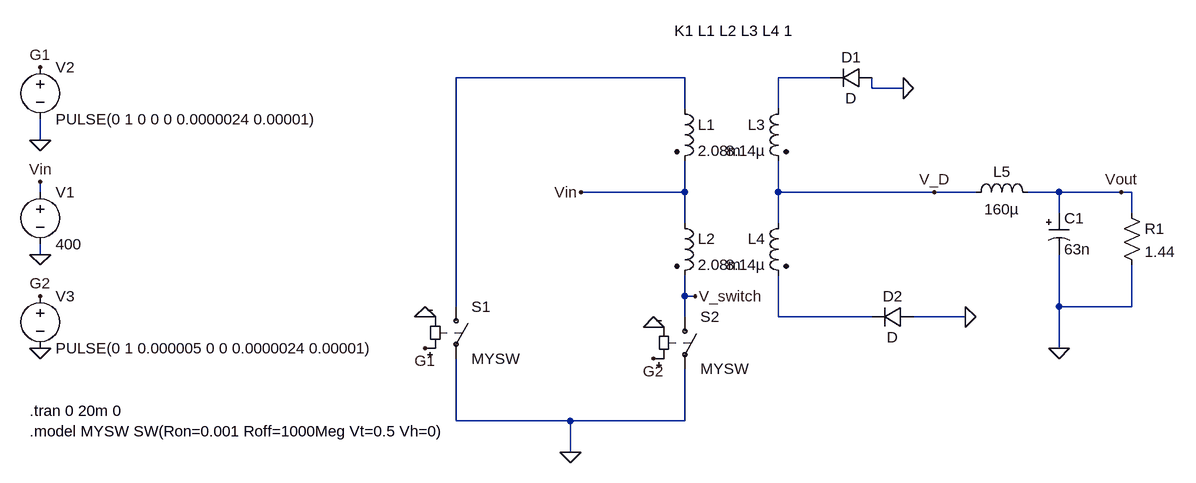
[diagram p0: schematic Analytical_Calculated_Circuit.asc]
Analytical_Calculated_Circuit.asc, the LTspice schematic file:
Version 4
SHEET 1 2220 680
WIRE 1232 -288 880 -288
WIRE 1456 -288 1376 -288
WIRE 1520 -272 1520 -288
WIRE 1568 -272 1520 -272
WIRE 1232 -240 1232 -288
WIRE 1376 -240 1376 -288
WIRE 240 -192 240 -224
WIRE 240 -112 240 -128
WIRE 1232 -112 1232 -160
WIRE 1232 -112 1072 -112
WIRE 1376 -112 1376 -160
WIRE 1616 -112 1376 -112
WIRE 1680 -112 1616 -112
WIRE 1808 -112 1760 -112
WIRE 1904 -112 1808 -112
WIRE 1920 -112 1904 -112
WIRE 1808 -80 1808 -112
WIRE 1920 -80 1920 -112
WIRE 1232 -64 1232 -112
WIRE 1376 -64 1376 -112
WIRE 240 -16 240 -32
WIRE 1232 48 1232 16
WIRE 1248 48 1232 48
WIRE 880 64 880 -288
WIRE 1808 64 1808 -16
WIRE 1920 64 1920 0
WIRE 1920 64 1808 64
WIRE 1232 80 1232 48
WIRE 1376 80 1376 16
WIRE 1520 80 1376 80
WIRE 1664 80 1584 80
WIRE 1808 128 1808 64
WIRE 880 240 880 144
WIRE 1056 240 880 240
WIRE 1232 240 1232 160
WIRE 1232 240 1056 240
WIRE 1056 288 1056 240
FLAG 240 -16 0
FLAG 240 -128 Vin
FLAG 240 128 0
FLAG 240 -192 0
FLAG 240 -304 G1
FLAG 240 48 G2
FLAG 1904 -112 Vout
FLAG 1072 -112 Vin
FLAG 1808 128 0
FLAG 832 80 0
FLAG 832 128 G1
FLAG 1184 96 0
FLAG 1184 144 G2
FLAG 1056 288 0
FLAG 1616 -112 V_D
FLAG 1248 48 V_switch
FLAG 1568 -272 0
FLAG 1664 80 0
SYMBOL voltage 240 -128 R0
WINDOW 123 0 0 Left 0
WINDOW 39 0 0 Left 0
SYMATTR InstName V1
SYMATTR Value 400
SYMBOL voltage 240 -320 R0
SYMATTR InstName V2
SYMATTR Value PULSE(0 1 0 0 0 0.0000024 0.00001)
SYMBOL voltage 240 32 R0
SYMATTR InstName V3
SYMATTR Value PULSE(0 1 0.000005 0 0 0.0000024 0.00001)
SYMBOL ind2 1216 -256 R0
SYMATTR InstName L1
SYMATTR Value 2.08m
SYMATTR Type ind
SYMBOL ind2 1216 -80 R0
SYMATTR InstName L2
SYMATTR Value 2.08m
SYMATTR Type ind
SYMBOL ind2 1392 -256 M0
SYMATTR InstName L3
SYMATTR Value 8.14µ
SYMATTR Type ind
SYMBOL ind2 1392 -80 M0
SYMATTR InstName L4
SYMATTR Value 8.14µ
SYMATTR Type ind
SYMBOL ind 1664 -96 R270
WINDOW 0 32 56 VTop 2
WINDOW 3 5 56 VBottom 2
SYMATTR InstName L5
SYMATTR Value 160µ
SYMBOL res 1904 -96 R0
SYMATTR InstName R1
SYMATTR Value 1.44
SYMBOL polcap 1792 -80 R0
WINDOW 3 24 56 Left 2
SYMATTR Value 63n
SYMATTR InstName C1
SYMATTR Description Capacitor
SYMATTR Type cap
SYMATTR SpiceLine V=100 Irms=720m Lser=0
SYMBOL sw 880 48 R0
SYMATTR InstName S1
SYMATTR Value MYSW
SYMBOL sw 1232 64 R0
SYMATTR InstName S2
SYMATTR Value MYSW
SYMBOL diode 1520 -304 R90
WINDOW 0 0 32 VBottom 2
WINDOW 3 32 32 VTop 2
SYMATTR InstName D1
SYMBOL diode 1584 64 R90
WINDOW 0 0 32 VBottom 2
WINDOW 3 32 32 VTop 2
SYMATTR InstName D2
TEXT 224 224 Left 2 !.tran 0 20m 0
TEXT 224 256 Left 2 !.model MYSW SW(Ron=0.001 Roff=1000Meg Vt=0.5 Vh=0)
TEXT 1216 -360 Left 2 !K1 L1 L2 L3 L4 1

The netlist it stands for:
* Analytical_Calculated_Circuit.asc
V1 Vin 0 400
V2 G1 0 PULSE(0 1 0 0 0 0.0000024 0.00001)
V3 G2 0 PULSE(0 1 0.000005 0 0 0.0000024 0.00001)
L1 N001 Vin 2.08m
L2 Vin V_switch 2.08m
L3 N002 V_D 8.14µ
L4 V_D N003 8.14µ
L5 V_D Vout 160µ
R1 Vout 0 1.44
C1 Vout 0 63n V=100 Irms=720m Lser=0
S1 N001 0 G1 0 MYSW
S2 V_switch 0 G2 0 MYSW
D1 0 N002 D
D2 0 N003 D
.model D D
.lib standard.dio
.tran 0 20m 0
.model MYSW SW(Ron=0.001 Roff=1000Meg Vt=0.5 Vh=0)
K1 L1 L2 L3 L4 1
.backanno
.end